# EAGLE design PS2RTC (EAGLE 8.0.0)
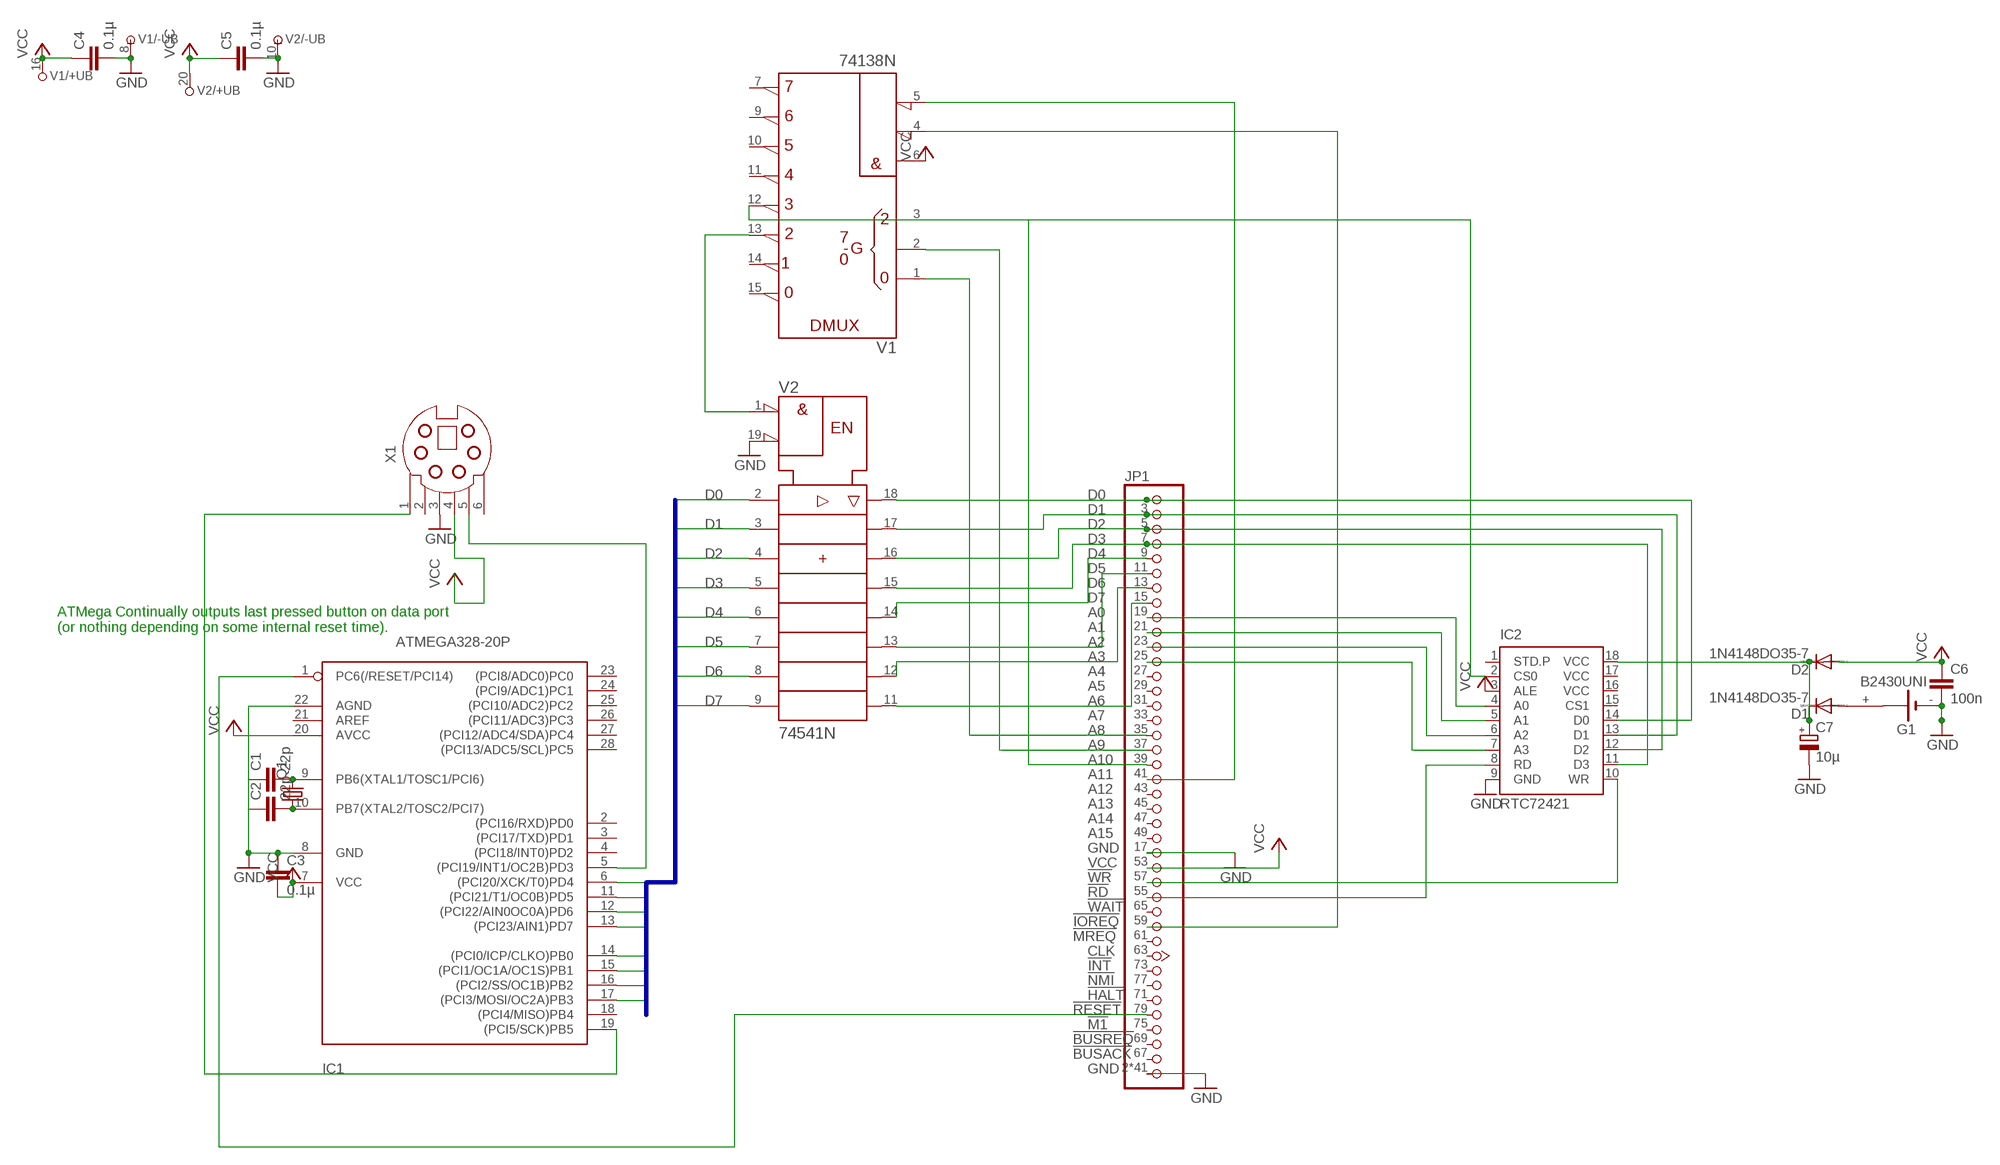
[diagram p0: schematic, sheet 1]

## Parts
C1  22p  C5/3  [C5B3]
C2  22p  C5/3  [C5B3]
C3  0.1µ  C5/3  [C5B3]
C4  0.1µ  C5/3  [C5B3]
C5  0.1µ  C5/3  [C5B3]
C6  100n  C2.5/2  [C2.5-2]
C7  10µ  CPOL-EUE2-4  [E2-4]
D1  1N4148DO35-7  [DO35-7]
D2  1N4148DO35-7  [DO35-7]
G1  B2430UNI  [B2430UNI]
IC1  ATMEGA328-20P  [DIL28-3]
IC2  RTC72421  [DIL18]
JP1  JEANNECTOR/90  [2X25/90]
Q1  CRYSTALHC49S  [HC49/S]
V1  74138N  [DIL16]
V2  74541N  [DIL20]
X1  MDSSV-F06  [SSV-BC06]

## Nets
D0: IC1.6((PCI20/XCK/T0)PD4) V2.2(A1)
D1: IC1.11((PCI21/T1/OC0B)PD5) V2.3(A2)
D2: IC1.12((PCI22/AIN0OC0A)PD6) V2.4(A3)
D3: IC1.13((PCI23/AIN1)PD7) V2.5(A4)
D4: IC1.14((PCI0/ICP/CLKO)PB0) V2.6(A5)
D5: IC1.15((PCI1/OC1A/OC1S)PB1) V2.7(A6)
D6: IC1.16((PCI2/SS/OC1B)PB2) V2.8(A7)
D7: IC1.17((PCI3/MOSI/OC2A)PB3) V2.9(A8)
GND: C3.1 C4.2 C5.2 C6.2 C7.- G1.- IC1.8(GND) IC1.22(AGND) IC2.9(GND) JP1.2(GND) JP1.4(GND) JP1.6(GND) JP1.8(GND) JP1.10(GND) JP1.12(GND) JP1.14(GND) JP1.16(GND) JP1.17(GND) JP1.18(GND) JP1.20(GND) JP1.22(GND) JP1.24(GND) JP1.26(GND) JP1.28(GND) JP1.30(GND) JP1.32(GND) JP1.34(GND) JP1.36(GND) JP1.38(GND) JP1.40(GND) JP1.42(GND) JP1.44(GND) JP1.46(GND) JP1.48(GND) JP1.50(GND) JP1.51(GND) JP1.52(GND) JP1.54(GND) JP1.56(GND) JP1.58(GND) JP1.60(GND) JP1.62(GND) JP1.64(GND) JP1.66(GND) JP1.68(GND) JP1.70(GND) JP1.72(GND) JP1.74(GND) JP1.76(GND) JP1.78(GND) JP1.80(GND) V1.8(-UB) V2.10(-UB) V2.19(!G2) X1.3
N$1: JP1.35(A8) V1.1(A)
N$2: JP1.37(A9) V1.2(B)
N$3: JP1.39(A10) V1.3(C)
N$4: IC1.5((PCI19/INT1/OC2B)PD3) X1.5
N$5: V1.13(Y2) V2.1(!G1)
N$6: IC1.19((PCI5/SCK)PB5) X1.1
N$7: JP1.59(!IOREQ) V1.4(!G2A)
N$8: JP1.41(A11) V1.5(!G2B)
N$9: IC2.14(D0) JP1.1(D0) V2.18(Y1)
N$10: IC2.13(D1) JP1.3(D1) V2.17(Y2)
N$11: IC2.12(D2) JP1.5(D2) V2.16(Y3)
N$12: IC2.11(D3) JP1.7(D3) V2.15(Y4)
N$13: JP1.9(D4) V2.14(Y5)
N$14: JP1.11(D5) V2.13(Y6)
N$15: JP1.13(D6) V2.12(Y7)
N$16: JP1.15(D7) V2.11(Y8)
N$17: IC1.1(PC6(/RESET/PCI14)) JP1.79(!RESET)
N$18: C1.2 IC1.9(PB6(XTAL1/TOSC1/PCI6)) Q1.2
N$19: C2.2 IC1.10(PB7(XTAL2/TOSC2/PCI7)) Q1.1
N$20: D1.A G1.+
N$21: IC2.4(A0) JP1.19(A0)
N$22: IC2.5(A1) JP1.21(A1)
N$23: C7.+ D1.C D2.C IC2.18(VCC)
N$24: IC2.6(A2) JP1.23(A2)
N$25: IC2.7(A3) JP1.25(A3)
N$26: IC2.8(RD) JP1.55(!RD)
N$27: IC2.10(WR) JP1.57(!WR)
N$28: IC2.2(CS0) V1.12(Y3)
VCC: C3.2 C4.1 C5.1 C6.1 D2.A IC1.7(VCC) IC1.20(AVCC) IC2.3(ALE) JP1.53(VCC) V1.6(G1) V1.16(+UB) V2.20(+UB) X1.4
Unconnected: C1.1 C2.1 G1.+@1(+) G1.+@2(+) G1.+@3(+) G1.+@4(+) G1.-@1(-) IC1.2((PCI16/RXD)PD0) IC1.3((PCI17/TXD)PD1) IC1.4((PCI18/INT0)PD2) IC1.18((PCI4/MISO)PB4) IC1.21(AREF) IC1.23((PCI8/ADC0)PC0) IC1.24((PCI9/ADC1)PC1) IC1.25((PCI10/ADC2)PC2) IC1.26((PCI11/ADC3)PC3) IC1.27((PCI12/ADC4/SDA)PC4) IC1.28((PCI13/ADC5/SCL)PC5) IC2.1(STD.P) IC2.15(CS1) JP1.27(A4) JP1.29(A5) JP1.31(A6) JP1.33(A7) JP1.43(A12) JP1.45(A13) JP1.47(A14) JP1.49(A15) JP1.61(!MREQ) JP1.63(CLK) JP1.65(!WAIT) JP1.67(!BUSACK) JP1.69(!BUSRQ) JP1.71(!HALT) JP1.73(!INT) JP1.75(!M1) JP1.77(!NMI) V1.7(Y7) V1.9(Y6) V1.10(Y5) V1.11(Y4) V1.14(Y1) V1.15(Y0) X1.2 X1.6

## Buses
D[0..7]

## Notes on the sheet
- ATMega Continually outputs last pressed button on data port
  (or nothing depending on some internal reset time).

## Power pins joined to a net without a drawn wire
VCC: IC2.16(VCC) IC2.17(VCC)

## Library data of the parts
C1-C6 = capacitor-wima:C: CAPACITOR naming: grid - package width
C7 = rcl:CPOL-EU: POLARIZED CAPACITOR, European symbol
D1 D2 = diode:1N4148: DIODE high speed (Philips)
G1 = battery:B2430UNI: LI BATTERY
IC1 = atmega328:ATMEGA328*P: MICROCONTROLLER 32 kBytes FLASH 2 kBytes SRAM 1 kBytes EEPROM USART 8-channel 10 bit ADC
IC2 = fox-electronics:RTC72421: Real Time Clock http://www.foxonline.com/72421.htm; MPN: RTC72421B; OC_FARNELL: 1216228; OC_NEWARK: 01M8738
JP1 = jean:JEANNECTOR: PIN HEADER
Q1 = crystal:CRYSTAL: CRYSTAL; OC_FARNELL: 1667008; OC_NEWARK: unknown
V1 = 74ttl-din:74*138: 3-line to 8-line DECODER/DEMULTIPLEXER
V2 = 74ttl-din:74*541: Octal BUFFER and LINE DRIVER, 3-state
X1 = con-yamaichi:MDSSV-F06: YAMAICHI CONNECTOR; OC_FARNELL: unknown; OC_NEWARK: unknown

## Board
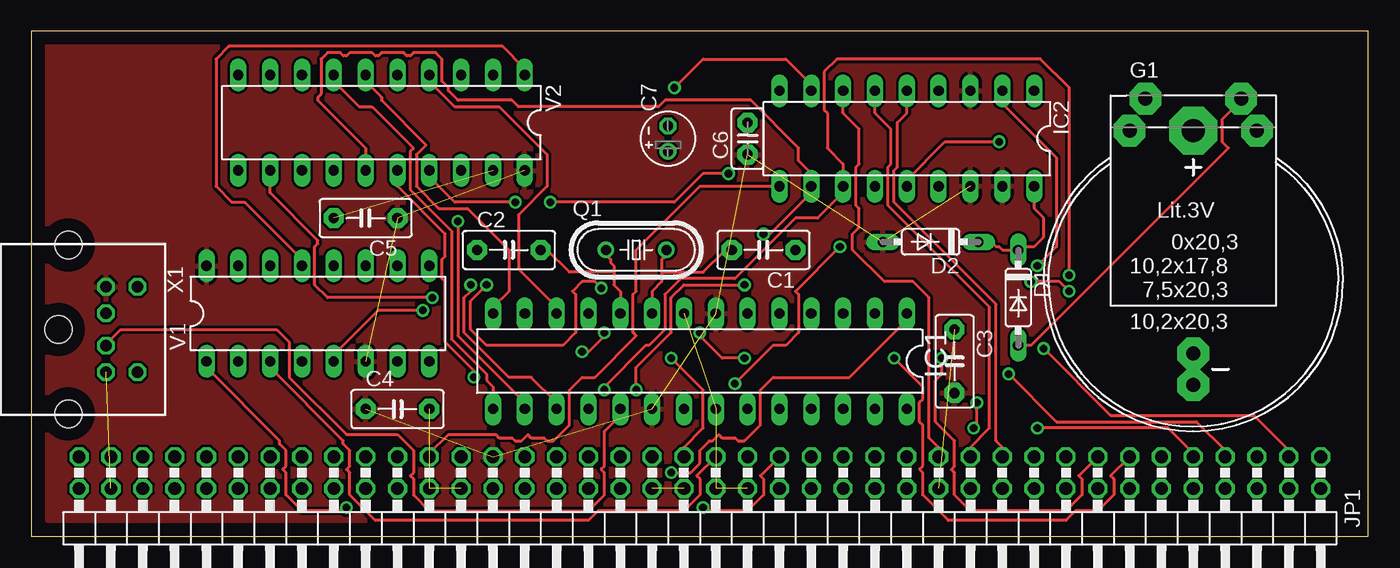
[diagram p1: board, top side]
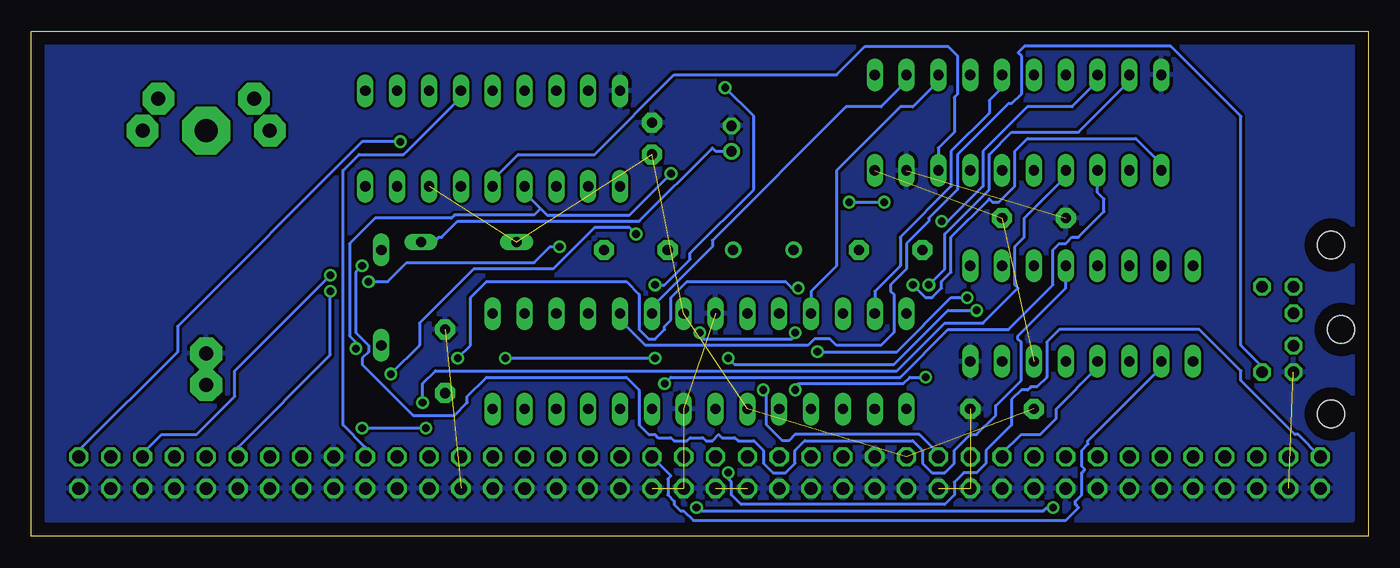
[diagram p2: board, bottom side, seen from below]

Size 106.66 x 40.31 mm. Coordinates in mm from the lower left corner, seen from the top.
Outline: 0,0 106.66,0 106.66,40.31 0,40.31 0,0
Copper layers (1*16): Top 0.035mm / dielectric 1.5mm / Bottom 0.035mm
Design rules "default": minimum track width 10mil, minimum drill 24mil, track to track 8mil, track to pad 8mil, pad to pad 8mil, via to via 8mil, smd to smd 8mil, copper to edge 40mil, drill to drill 8mil, minimum pad ring 10mil, minimum via ring 8mil, stop-mask expansion 4mil, vias tented up to drill 0mil, thermal gap 10mil

### Footprints (pad centres in the part's own frame; a part is rotated, then mirrored left to right if it is on the bottom)
C5B3 = drill 0.813 pad 1.6 octagon: 1 -2.54,0; 2 2.54,0
C2.5-2 = drill 0.813 pad 1.6 octagon: 1 -1.27,0; 2 1.27,0
E2-4 = drill 0.813 pad 1.27: + -1.016,0 | drill 0.813 pad 1.27 octagon: - 1.016,0
DO35-7 = drill 0.813 long: A 3.81,0; C -3.81,0
B2430UNI = drill 1.118 pad 2.54 octagon: + 3.81,14.605; +@1 -3.81,14.605; +@2 -5.08,12.065; +@3 5.08,12.065; - 0,-5.715; -@1 0,-8.255 | drill 1.803 pad 3.81 octagon: +@4 0,12.065
DIL28-3 = drill 0.813 long: 1 -16.51,-3.81; 2 -13.97,-3.81; 3 -11.43,-3.81; 4 -8.89,-3.81; 5 -6.35,-3.81; 6 -3.81,-3.81; 7 -1.27,-3.81; 8 1.27,-3.81; 9 3.81,-3.81; 10 6.35,-3.81; 11 8.89,-3.81; 12 11.43,-3.81; 13 13.97,-3.81; 14 16.51,-3.81; 15 16.51,3.81; 16 13.97,3.81; 17 11.43,3.81; 18 8.89,3.81; 19 6.35,3.81; 20 3.81,3.81; 21 1.27,3.81; 22 -1.27,3.81; 23 -3.81,3.81; 24 -6.35,3.81; 25 -8.89,3.81; 26 -11.43,3.81; 27 -13.97,3.81; 28 -16.51,3.81
DIL18 = drill 0.813 long: 1 -10.16,-3.81; 2 -7.62,-3.81; 3 -5.08,-3.81; 4 -2.54,-3.81; 5 0,-3.81; 6 2.54,-3.81; 7 5.08,-3.81; 8 7.62,-3.81; 9 10.16,-3.81; 10 10.16,3.81; 11 7.62,3.81; 12 5.08,3.81; 13 2.54,3.81; 14 0,3.81; 15 -2.54,3.81; 16 -5.08,3.81; 17 -7.62,3.81; 18 -10.16,3.81
2X25/90 = drill 1.016 octagon: 1 -29.21,-6.35; 2 -29.21,-3.81; 3 -26.67,-6.35; 4 -26.67,-3.81; 5 -24.13,-6.35; 6 -24.13,-3.81; 7 -21.59,-6.35; 8 -21.59,-3.81; 9 -19.05,-6.35; 10 -19.05,-3.81; 11 -16.51,-6.35; 12 -16.51,-3.81; 13 -13.97,-6.35; 14 -13.97,-3.81; 15 -11.43,-6.35; 16 -11.43,-3.81; 17 -8.89,-6.35; 18 -8.89,-3.81; 19 -6.35,-6.35; 20 -6.35,-3.81; 21 -3.81,-6.35; 22 -3.81,-3.81; 23 -1.27,-6.35; 24 -1.27,-3.81; 25 1.27,-6.35; 26 1.27,-3.81; 27 3.81,-6.35; 28 3.81,-3.81; 29 6.35,-6.35; 30 6.35,-3.81; 31 8.89,-6.35; 32 8.89,-3.81; 33 11.43,-6.35; 34 11.43,-3.81; 35 13.97,-6.35; 36 13.97,-3.81; 37 16.51,-6.35; 38 16.51,-3.81; 39 19.05,-6.35; 40 19.05,-3.81; 41 21.59,-6.35; 42 21.59,-3.81; 43 24.13,-6.35; 44 24.13,-3.81; 45 26.67,-6.35; 46 26.67,-3.81; 47 29.21,-6.35; 48 29.21,-3.81; 49 31.75,-6.35; 50 31.75,-3.81; 51 34.29,-6.35; 52 34.29,-3.81; 53 36.83,-6.35; 54 36.83,-3.81; 55 39.37,-6.35; 56 39.37,-3.81; 57 41.91,-6.35; 58 41.91,-3.81; 59 44.45,-6.35; 60 44.45,-3.81; 61 46.99,-6.35; 62 46.99,-3.81; 63 49.53,-6.35; 64 49.53,-3.81; 65 52.07,-6.35; 66 52.07,-3.81; 67 54.61,-6.35; 68 54.61,-3.81; 69 57.15,-6.35; 70 57.15,-3.81; 71 59.69,-6.35; 72 59.69,-3.81; 73 62.23,-6.35; 74 62.23,-3.81; 75 64.77,-6.35; 76 64.77,-3.81; 77 67.31,-6.35; 78 67.31,-3.81; 79 69.85,-6.35; 80 69.85,-3.81
HC49/S = drill 0.813: 1 -2.413,0; 2 2.413,0
DIL16 = drill 0.813 long: 1 -8.89,-3.81; 2 -6.35,-3.81; 3 -3.81,-3.81; 4 -1.27,-3.81; 5 1.27,-3.81; 6 3.81,-3.81; 7 6.35,-3.81; 8 8.89,-3.81; 9 8.89,3.81; 10 6.35,3.81; 11 3.81,3.81; 12 1.27,3.81; 13 -1.27,3.81; 14 -3.81,3.81; 15 -6.35,3.81; 16 -8.89,3.81
DIL20 = drill 0.813 long: 1 -11.43,-3.81; 2 -8.89,-3.81; 3 -6.35,-3.81; 4 -3.81,-3.81; 5 -1.27,-3.81; 6 1.27,-3.81; 7 3.81,-3.81; 8 6.35,-3.81; 9 8.89,-3.81; 10 11.43,-3.81; 11 11.43,3.81; 12 8.89,3.81; 13 6.35,3.81; 14 3.81,3.81; 15 1.27,3.81; 16 -1.27,3.81; 17 -3.81,3.81; 18 -6.35,3.81; 19 -8.89,3.81; 20 -11.43,3.81
SSV-BC06 = drill 0.9 octagon: 1 1.3,8.5; 2 -1.3,8.5; 3 3.4,8.5; 4 -3.4,8.5; 5 3.4,11; 6 -3.4,11 | hole 2.2: -6.75,5.5; 0,4.7; 6.75,5.5

### Placement (x,y rotation side)
C1  58.42,22.86 180 top
C2  38.1,22.86 0 top
C3  73.66,13.97 270 top
C4  29.21,10.16 0 top
C5  26.67,25.4 180 top
C6  57.15,31.75 90 top
C7  50.8,31.75 90 top
D1  78.74,19.05 270 top
D2  71.75,23.5 180 top
G1  92.71,20.32 0 top
IC1  53.34,13.97 180 top
IC2  69.85,31.75 180 top
JP1  73.66,0 180 top
Q1  48.26,22.86 0 top
V1  22.86,17.78 0 top
V2  27.94,33.02 180 top
X1  -2.54,16.51 270 top

### Tracks (layer width: path | path; a pad name or v marks a point on that pad's centre or on a via)
D0
  Bottom 0.254: IC1.6 57.15,18.29 52.32,23.11 52.32,23.62 41.66,34.29 38.86,34.29 36.83,36.32 V2.2
D1
  Bottom 0.254: IC1.11 44.45,19.56 42.42,21.59 42.42,29.21 37.34,34.29 36.32,34.29 34.29,36.32 V2.3
D2
  Top 0.254: IC1.12 41.91,18.29 38.86,21.34 38.86,25.65 41.15,27.94 41.15,30.48 37.34,34.29 33.78,34.29 31.75,36.32 V2.4
D3
  Bottom 0.254: IC1.13 39.37,19.56 37.34,21.59 37.34,23.88 33.27,27.94 33.27,30.73 30.23,33.78 30.23,34.8 29.21,35.81 V2.5
D4
  Top 0.254: IC1.14 36.83,18.29 38.1,19.56 38.1,22.86 34.8,26.16 32.51,26.16 30.73,27.94 30.73,30.48 31.5,31.24 27.94,34.8 27.94,35.05 26.67,36.32 V2.6
D5
  Top 0.254: IC1.15 36.83,11.94 36.32,12.45 36.32,12.95 33.53,15.75 33.53,24.38 30.23,27.69 30.23,30.73 30.48,30.99 27.18,34.29 26.16,34.29 24.13,36.32 V2.7
D6  (via drill 0.61)
  Top 0.254: IC1.16 39.37,10.67 34.04,16 v34.04,25.15
  Bottom 0.254: v34.04,25.15 33.53,25.15 30.73,27.94 30.73,30.73 27.18,34.29 23.62,34.29 21.59,36.32 V2.8
D7  (via drill 0.61)
  Top 0.254: v35.05,20.07 35.05,19.56 34.54,19.05 34.54,16.26 38.1,12.7 39.88,12.7 41.91,10.67 IC1.17
  Bottom 0.254: V2.9 19.05,36.32 23.11,32.26 28.45,32.26 30.23,30.48 30.23,27.69 33.78,24.13 33.78,21.34 v35.05,20.07
GND  (9 unrouted)
  pour Bottom: 1.27,39.37 1.27,1.27 105.41,1.27 105.41,39.37
N$1  (via drill 0.61)
  Top 0.254: V1.1 13.97,13.46 19.81,7.62 19.81,7.37 20.32,6.86 20.32,5.59 20.07,5.33 20.32,5.08 20.32,3.3 21.59,2.03 24.89,2.03 v25.15,2.29 | v53.59,2.29 53.85,2.03 57.15,2.03 58.42,3.3 58.42,4.57 58.17,4.83 JP1.35
  Bottom 0.254: v25.15,2.29 25.65,2.29 25.91,2.03 53.34,2.03 v53.59,2.29
N$2
  Bottom 0.254: V1.2 16.51,13.46 22.35,7.62 22.35,7.37 22.86,6.86 22.86,5.59 22.61,5.33 22.86,5.08 22.86,3.3 23.37,2.79 23.37,2.54 23.11,2.29 24.13,1.27 53.85,1.27 54.61,2.03 54.86,2.03 55.37,2.54 55.37,2.79 55.88,3.3 55.88,4.57 55.63,4.83 JP1.37
N$3
  Top 0.254: V1.3 19.05,13.46 24.89,7.62 24.89,7.37 25.4,6.86 25.4,5.59 25.15,5.33 25.4,5.08 25.4,3.3 27.43,1.27 44.45,1.27 45.21,2.03 52.07,2.03 53.34,3.3 53.34,4.57 53.09,4.83 JP1.39
N$4
  Bottom 0.254: IC1.5 59.69,17.27 57.66,15.24 44.7,15.24 44.2,15.75 42.93,15.75 42.42,15.24 38.86,15.24 37.85,16.26 37.85,19.3 38.1,19.56 38.1,20.07 36.83,21.34 36.83,23.37 35.05,25.15 35.05,25.4 32.77,27.69 32.77,30.48 28.7,34.54 28.45,34.54 27.69,35.31 27.69,38.35 27.94,38.61 27.43,39.12 15.75,39.12 10.16,33.53 10.16,15.24 8.64,13.72 8.64,13.21 X1.5
N$5
  Top 0.254: V1.13 21.59,22.1 17.02,26.67 16,26.67 14.73,27.94 14.73,38.1 15.75,39.12 37.59,39.12 39.37,37.34 V2.1
N$6
  Top 0.254: IC1.19 46.99,9.65 45.72,8.38 45.72,5.59 45.47,5.33 45.72,5.08 45.72,3.3 44.45,2.03 31.75,2.03 30.48,3.3 30.48,4.57 30.23,4.83 30.48,5.08 30.48,6.86 29.21,8.13 25.15,8.13 20.57,12.7 20.57,15.49 19.56,16.51 7.11,16.51 5.84,15.24 X1.1
N$7
  Bottom 0.254: V1.4 21.59,13.46 24.89,10.16 24.89,9.4 26.16,8.13 27.69,8.13 29.21,6.6 JP1.59
N$8  (via drill 0.61)
  Top 0.254: V1.5 24.13,14.48 27.69,18.03 v31.24,18.03 | v51.05,14.22 53.59,11.68 53.59,8.64 52.07,7.11 JP1.41
  Bottom 0.254: v31.24,18.03 33.53,18.03 37.85,13.72 50.55,13.72 v51.05,14.22
N$9  (via drill 0.61)
  Top 0.254: v77.22,31.5 72.9,31.5 69.85,28.45 IC2.14
  Bottom 0.254: V2.18 34.29,30.99 33.02,32.26 33.02,35.05 32.77,35.31 32.77,38.35 33.53,39.12 40.13,39.12 42.42,36.83 55.37,36.83 61.72,30.48 67.82,30.48 69.85,28.45 IC2.14 | JP1.1 102.87,6.86 95,14.73 95,16.76 80.26,31.5 v77.22,31.5
N$10  (via drill 0.61)
  Top 0.254: V2.17 31.75,28.7 33.78,26.67 v38.61,26.67 | v41.4,26.67 51.31,26.67 53.59,28.96 v55.63,28.96 | JP1.3 100.33,6.86 97.54,9.65 86.11,9.65 v80.77,14.99
  Bottom 0.254: v41.4,26.67 v38.61,26.67 | v55.63,28.96 58.93,25.65 65.53,25.65 66.04,26.16 | 66.04,26.16 67.31,27.43 IC2.13 | v80.77,14.99 80.77,15.49 81.28,16 81.28,23.37 79.25,25.4 73.15,25.4 72.9,25.65 66.55,25.65 66.04,26.16
N$11  (via drill 0.61)
  Top 0.254: v82.8,20.83 82.8,35.81 80.52,38.1 64.26,38.1 63.25,37.08 63.25,34.04 63.5,33.78 63.5,30.99 64.77,29.72 IC2.12 64.77,27.43 62.74,25.4 60.96,25.4 56.13,20.57 51.82,20.57 50.55,19.3 50.55,16.51 49.28,15.24 49.02,15.24 45.72,11.94 v45.72,11.68 | V2.16 29.21,27.94 33.02,24.13 33.02,22.35 32.77,22.1 32.77,20.57 33.02,20.32 33.02,15.49 35.31,13.21 v35.31,12.7
  Bottom 0.254: v82.8,20.83 90.42,13.21 90.42,11.18 93.47,8.13 96.27,8.13 97.79,6.6 JP1.5 | v35.31,12.7 36.58,12.7 37.08,12.19 45.47,12.19 45.72,11.94 v45.72,11.68
N$12  (via drill 0.61)
  Top 0.254: V2.15 26.67,30.99 22.86,34.8 22.86,35.05 23.11,35.31 23.11,38.1 23.62,38.61 24.64,38.61 24.89,38.35 25.15,38.35 25.4,38.61 27.18,38.61 27.43,38.35 27.69,38.35 27.94,38.61 29.72,38.61 29.97,38.35 30.23,38.35 30.48,38.61 32.26,38.61 32.77,38.1 32.77,36.32 33.27,35.81 33.27,35.56 34.04,34.8 38.35,34.8 38.86,34.29 50.04,34.29 50.55,34.8 57.4,34.8 61.21,30.99 61.21,29.97 62.23,28.96 IC2.11 62.23,27.43 58.93,24.13 v58.42,24.13 | JP1.7 95.25,6.86 92.96,9.14 81.79,9.14 v77.98,12.95
  Bottom 0.254: v77.98,12.95 75.69,15.24 75.69,17.02 71.37,21.34 65.02,21.34 61.72,24.64 58.93,24.64 v58.42,24.13
N$13  (via drill 0.61)
  Top 0.254: v75.44,10.67 75.44,8.89 v75.18,8.64 | v80.26,8.64 90.68,8.64 92.71,6.6 JP1.9
  Bottom 0.254: V2.14 24.13,28.7 27.43,25.4 27.43,23.88 28.19,23.11 28.19,20.07 27.94,19.81 30.73,17.02 33.78,17.02 37.59,13.21 74.42,13.21 75.44,12.19 v75.44,10.67 | v80.26,8.64 v75.18,8.64
N$14  (via drill 0.61)
  Top 0.254: v56.13,12.19 59.18,15.24 60.2,15.24 61.21,16.26 61.21,19.3 60.96,19.56 v64.52,23.11 | v79.76,20.32 82.04,20.32 v82.8,19.56
  Bottom 0.254: V2.13 21.59,27.43 21.08,26.92 21.08,25.91 23.11,23.88 23.62,23.88 24.13,23.37 24.64,23.37 25.15,22.86 25.15,20.07 28.7,16.51 33.53,16.51 37.34,12.7 55.63,12.7 v56.13,12.19 | v64.52,23.11 65.28,23.11 66.55,21.84 76.71,21.84 78.23,20.32 v79.76,20.32 | v82.8,19.56 82.8,14.48 90.17,7.11 JP1.11
N$15  (via drill 0.61)
  Top 0.254: V2.12 19.05,27.43 22.86,23.62 22.86,23.37 22.61,23.11 22.61,20.07 23.62,19.05 v32,19.05 | v43.94,14.73 44.45,14.73 45.72,16 v45.72,16.26 | v53.34,16.26 53.34,16 55.12,14.22 v56.9,14.22 | v68.83,14.22 71.12,11.94 71.12,10.92 70.87,10.67 70.87,9.14 71.12,8.89 71.12,5.59 70.87,5.33 71.12,5.08 71.12,3.3 73.15,1.27 82.55,1.27 83.31,2.03 85.09,2.03 86.36,3.3 86.36,4.57 86.11,4.83 JP1.13
  Bottom 0.254: v32,19.05 33.27,19.05 37.59,14.73 v43.94,14.73 | v45.72,16.26 45.72,16 45.97,15.75 53.09,15.75 53.34,16 v53.34,16.26 | v68.83,14.22 v56.9,14.22
N$16  (via drill 0.61)
  Top 0.254: v36.32,20.07 35.05,18.8 35.05,16.51 36.32,15.24 42.42,15.24 43.43,16.26 43.43,19.3 43.18,19.56 43.94,20.32 44.96,20.32 v45.47,19.81 | v72.64,14.22 72.64,12.95 72.14,12.45 72.14,9.14 73.66,7.62 73.66,5.59 73.41,5.33 73.66,5.08 73.66,3.3 74.93,2.03 82.55,2.03 83.82,3.3 83.82,4.57 83.57,4.83 JP1.15
  Bottom 0.254: V2.11 16.51,29.72 18.54,31.75 27.18,31.75 28.19,30.73 28.19,27.94 29.46,26.67 29.97,26.67 30.23,26.92 33.27,23.88 33.27,21.08 34.04,20.32 34.04,19.81 34.8,19.05 35.31,19.05 v36.32,20.07 | v45.47,19.81 45.97,19.81 46.48,20.32 54.36,20.32 55.63,19.05 55.63,17.27 56.13,16.76 56.13,16.51 56.9,15.75 57.4,15.75 58.17,16.51 58.17,19.3 59.18,20.32 70.36,20.32 71.63,19.05 71.63,15.24 v72.64,14.22
N$17  (via drill 0.61)
  Top 0.254: IC1.1 69.85,17.27 65.28,12.7 59.18,12.7 58.17,11.68 58.17,8.89 56.9,7.62 56.39,7.62 56.13,7.87 55.12,7.87 54.86,8.13 54.36,7.62 54.1,7.62 53.34,6.86 53.34,5.84 52.58,5.08 v51.05,5.08
  Bottom 0.254: v51.05,5.08 51.05,4.57 50.8,4.32 50.8,3.3 50.04,2.54 33.78,2.54 33.02,3.3 33.02,4.32 32.26,5.08 31.24,5.08 30.48,5.84 30.48,6.86 28.45,8.89 28.45,10.92 27.69,11.68 27.18,11.68 26.92,11.94 26.42,11.94 25.65,12.7 25.65,15.49 24.64,16.51 13.46,16.51 10.16,13.21 10.16,12.45 5.84,8.13 5.59,8.13 JP1.79
N$18
  Top 0.254: IC1.9 49.53,19.56 50.29,20.32 50.29,21.08 | 50.29,21.08 50.29,22.1 50.55,22.35 50.55,22.86 Q1.2 | C1.2 55.37,22.86 53.59,21.08 50.29,21.08
N$19
  Top 0.254: IC1.10 46.99,19.56 46.48,20.07 46.48,21.08 | 46.48,21.08 46.48,21.59 46.23,21.84 46.23,22.1 45.97,22.35 45.97,22.86 Q1.1 | C2.2 41.15,22.86 42.93,21.08 46.48,21.08
N$20
  Top 0.254: D1.A 79.76,15.24 95.5,30.99 95,31.5 95,33.27 96.52,34.8 G1.+
N$21
  Bottom 0.254: IC2.4 72.39,35.05 76.96,30.48 80.52,30.48 81.79,29.21 81.79,8.89 80.01,7.11 JP1.19
N$22
  Top 0.254: IC2.5 69.85,33.78 69.09,33.02 69.09,29.46 68.83,29.21 68.83,26.67 76.96,18.54 76.96,7.62 77.47,7.11 JP1.21
N$23
  Top 0.254: D2.C 75.69,23.37 76.71,23.37 76.96,23.11 77.22,23.11 77.47,22.86 D1.C 78.99,23.11 80.01,23.11 80.77,23.88 80.77,25.4 80.01,26.16 IC2.18
  Bottom 0.254: C7.+ 52.07,30.73 52.32,30.99 58.17,25.15 72.64,25.15 73.91,23.88 74.17,23.88 74.42,23.62 75.44,23.62 D2.C
N$24
  Top 0.254: IC2.6 67.31,33.78 68.58,32.51 68.58,29.72 68.33,29.46 68.33,26.42 76.45,18.29 76.45,8.64 74.93,7.11 JP1.23
N$25
  Top 0.254: IC2.7 64.77,33.78 66.04,32.51 66.04,29.72 65.79,29.46 65.79,26.42 66.04,26.16 66.04,24.64 65.53,24.13 65.53,22.86 68.07,20.32 70.36,20.32 71.63,19.05 71.63,7.87 72.39,7.11 JP1.25
N$26  (via drill 0.61)
  Top 0.254: IC2.8 62.23,36.07 60.2,38.1 53.59,38.1 v51.31,35.81 | v56.9,20.07 52.07,20.07 51.05,19.05 51.05,16.26 48.26,13.46 v48.26,11.68
  Bottom 0.254: v51.31,35.81 49.02,33.53 49.02,27.69 54.1,22.61 54.1,22.1 56.13,20.07 v56.9,20.07 | v48.26,11.68 48.01,11.43 48.01,8.89 46.74,7.62 46.23,7.62 45.72,8.13 35.81,8.13 34.29,6.6 JP1.55
N$27
  Top 0.254: IC2.10 53.34,27.94 48.26,22.86 48.26,19.56 48.01,19.3 48.01,16.26 48.26,16 44.96,12.7 43.94,12.7 42.93,11.68 42.93,8.89 41.66,7.62 41.15,7.62 40.89,7.87 39.88,7.87 39.62,8.13 39.12,7.62 38.61,7.62 38.35,7.87 37.34,7.87 37.08,8.13 33.27,8.13 31.75,6.6 JP1.57
N$28  (via drill 0.61)
  Top 0.254: v80.26,21.59 81.79,23.11 81.79,30.23 77.47,34.54 IC2.2
  Bottom 0.254: V1.12 24.13,19.81 27.94,16 27.94,15.75 27.69,15.49 27.69,12.45 29.72,10.41 29.72,9.65 31.24,8.13 31.75,8.13 33.02,6.86 33.02,5.84 33.78,5.08 34.8,5.08 35.56,5.84 35.56,6.86 36.32,7.62 44.96,7.62 45.72,6.86 45.72,5.84 46.48,5.08 47.5,5.08 48.26,5.84 48.26,6.86 49.02,7.62 50.29,7.62 50.55,7.87 51.56,7.87 51.82,8.13 52.32,7.62 52.83,7.62 53.09,7.87 54.1,7.87 54.36,7.62 55.37,7.62 55.63,7.87 56.64,7.87 56.9,8.13 57.4,8.13 58.17,8.89 58.17,11.68 59.18,12.7 70.36,12.7 71.88,11.18 71.88,10.67 72.9,9.65 76.2,9.65 80.26,13.72 80.26,14.22 79.76,14.73 79.76,15.24 80.77,16.26 80.77,21.08 v80.26,21.59
VCC  (8 unrouted)
  pour Top: 1.27,39.37 1.27,1.27 105.41,1.27 105.41,39.37